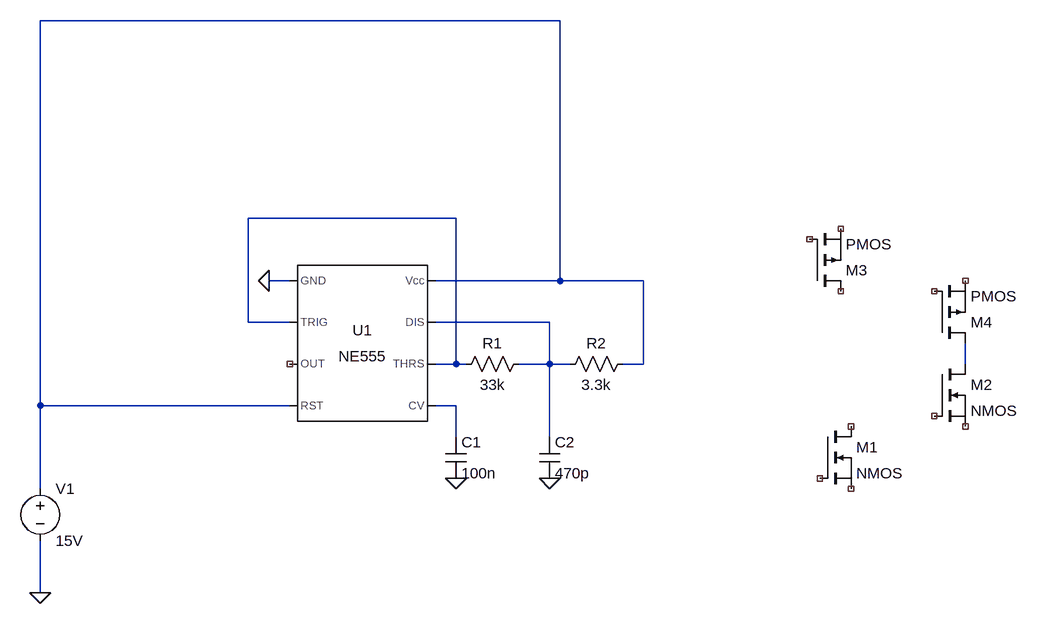
[diagram p0: schematic Draft3.asc]
Draft3.asc, the LTspice schematic file:
Version 4
SHEET 1 1180 680
WIRE 464 -304 -336 -304
WIRE 304 0 -16 0
WIRE 48 96 16 96
WIRE 464 96 464 -304
WIRE 464 96 272 96
WIRE 592 96 464 96
WIRE -16 160 -16 0
WIRE 48 160 -16 160
WIRE 448 160 272 160
WIRE 304 224 304 0
WIRE 304 224 272 224
WIRE 320 224 304 224
WIRE 448 224 448 160
WIRE 448 224 400 224
WIRE 480 224 448 224
WIRE 592 224 592 96
WIRE 592 224 560 224
WIRE 1088 224 1088 192
WIRE -336 288 -336 -304
WIRE 48 288 -336 288
WIRE 304 288 272 288
WIRE 304 336 304 288
WIRE 448 336 448 224
WIRE -336 416 -336 288
WIRE -336 576 -336 496
FLAG 16 96 0
FLAG -336 576 0
FLAG 304 400 0
FLAG 448 400 0
SYMBOL Misc\\NE555 160 192 R0
SYMATTR InstName U1
SYMBOL voltage -336 400 R0
WINDOW 123 0 0 Left 2
WINDOW 39 0 0 Left 2
SYMATTR InstName V1
SYMATTR Value 15V
SYMBOL res 416 208 R90
WINDOW 0 0 56 VBottom 2
WINDOW 3 32 56 VTop 2
SYMATTR InstName R1
SYMATTR Value 33k
SYMBOL res 576 208 R90
WINDOW 0 0 56 VBottom 2
WINDOW 3 32 56 VTop 2
SYMATTR InstName R2
SYMATTR Value 3.3k
SYMBOL cap 288 336 R0
SYMATTR InstName C1
SYMATTR Value 100n
SYMBOL cap 432 336 R0
SYMATTR InstName C2
SYMATTR Value 470p
SYMBOL nmos 864 320 R0
SYMATTR InstName M1
SYMBOL nmos 1040 224 R0
SYMATTR InstName M2
SYMBOL pmos 848 112 M180
SYMATTR InstName M3
SYMBOL pmos 1040 192 M180
SYMATTR InstName M4

The netlist it stands for:
* Draft3.asc
XU1 0 N002 NC_01 N001 N005 N002 N003 N001 NE555  ; pins GND TRIG OUT RST CV THRS DIS Vcc
V1 N001 0 15V
R1 N003 N002 33k
R2 N001 N003 3.3k
C1 N005 0 100n
C2 N003 0 470p
M1 NC_02 NC_03 NC_04 NC_04 NMOS
M2 N004 NC_05 NC_06 NC_06 NMOS
M3 NC_07 NC_08 NC_09 NC_09 PMOS
M4 N004 NC_10 NC_11 NC_11 PMOS
.model NMOS NMOS
.model PMOS PMOS
.lib standard.mos
.lib NE555.sub
.backanno
.end